# EAGLE schematic mx232JoeyAngShiYuan (EAGLE 8.1.0)
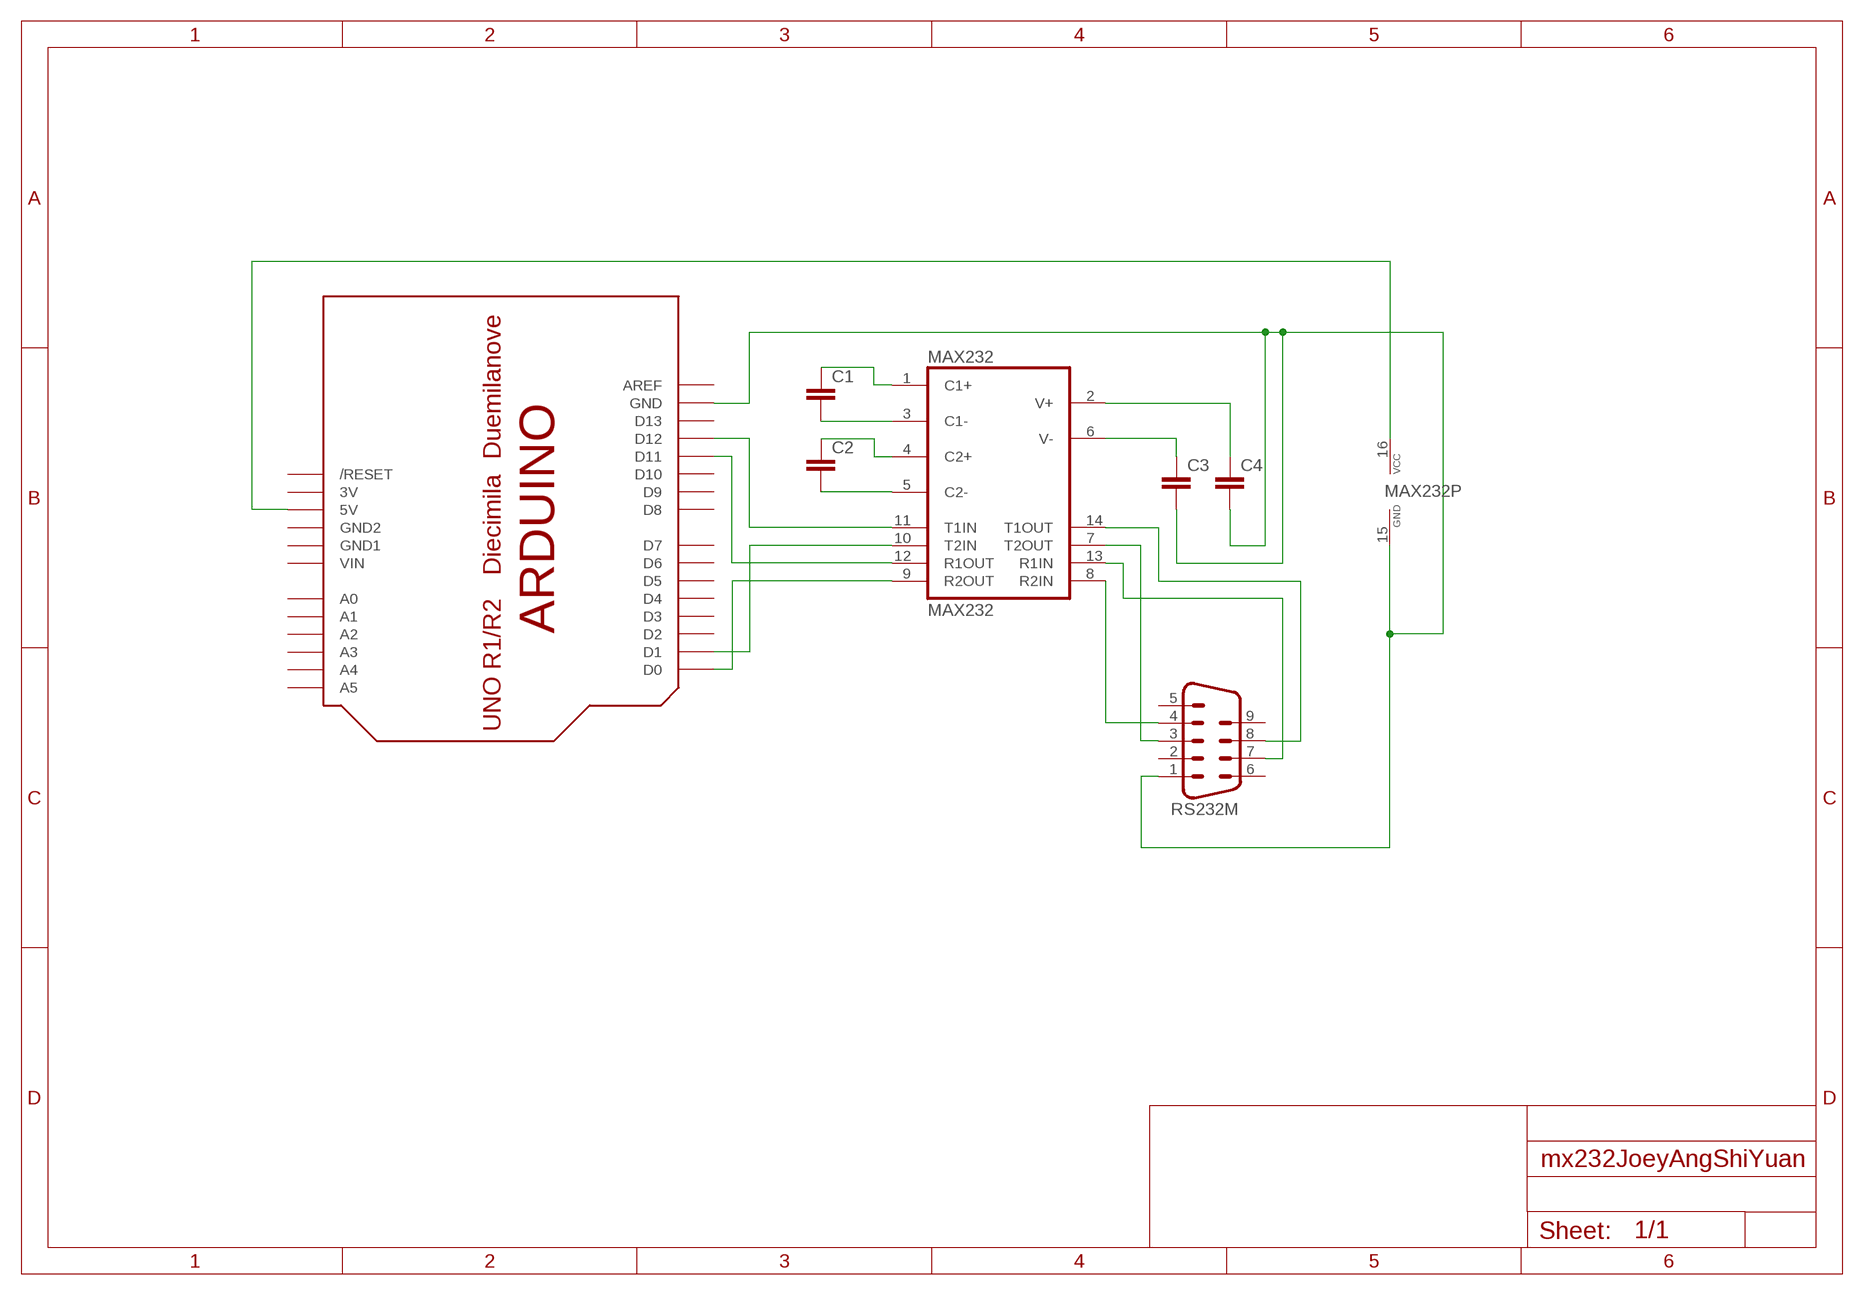
[diagram p0: schematic, sheet 1]

## Parts
C1  C2,5-3  [C2.5-3]
C2  C2,5-3  [C2.5-3]
C3  C2,5-3  [C2.5-3]
C4  C2,5-3  [C2.5-3]
LEONARDO-SHIELD  ARDUINO-NOHOLE  [ARDUINO-NOHOLE]
MAX232  MAX232  [DIL16]
RS232M  M09HP  [M09HP]

## Nets
N$1: LEONARDO-SHIELD.D11 MAX232.12(R1OUT)
N$2: LEONARDO-SHIELD.D0 MAX232.9(R2OUT)
N$3: LEONARDO-SHIELD.D1 MAX232.10(T2IN)
N$4: LEONARDO-SHIELD.D12 MAX232.11(T1IN)
N$5: C1.1 MAX232.1(C1+)
N$6: C1.2 MAX232.3(C1-)
N$7: C2.1 MAX232.4(C2+)
N$8: C2.2 MAX232.5(C2-)
N$9: C4.1 MAX232.2(V+)
N$10: C3.1 MAX232.6(V-)
N$11: C3.2 C4.2 LEONARDO-SHIELD.GND MAX232.15(GND) RS232M.1
N$12: LEONARDO-SHIELD.5V MAX232.16(VCC)
N$13: MAX232.14(T1OUT) RS232M.8
N$14: MAX232.7(T2OUT) RS232M.3
N$15: MAX232.13(R1IN) RS232M.7
N$16: MAX232.8(R2IN) RS232M.4
Unconnected: LEONARDO-SHIELD.A0 LEONARDO-SHIELD.A1 LEONARDO-SHIELD.A2 LEONARDO-SHIELD.A3 LEONARDO-SHIELD.A4 LEONARDO-SHIELD.A5 LEONARDO-SHIELD.AREF LEONARDO-SHIELD.D2 LEONARDO-SHIELD.D3 LEONARDO-SHIELD.D4 LEONARDO-SHIELD.D5 LEONARDO-SHIELD.D6 LEONARDO-SHIELD.D7 LEONARDO-SHIELD.D8 LEONARDO-SHIELD.D9 LEONARDO-SHIELD.D10 LEONARDO-SHIELD.D13 LEONARDO-SHIELD.RESET(/RESET) RS232M.2 RS232M.5 RS232M.6 RS232M.9

## Power pins joined to a net without a drawn wire
3V: LEONARDO-SHIELD.3V
GND1: LEONARDO-SHIELD.GND1
GND2: LEONARDO-SHIELD.GND2
VIN: LEONARDO-SHIELD.VIN

## Library data of the parts
C1-C4 = capacitor-wima:C: CAPACITOR naming: grid - package width
LEONARDO-SHIELD = adafruit:ARDUINO: Arduino Diecimila/Duemilanove Make a shield with ease, this package has all the named pins as well as the two mounting drill holes and an outline of the USB and DC power connector. The outline is on the DIMENSION layer, so if your board house uses it they will cut the outline to match. http://www.ladyada.net/library/pcb/eaglelibrary.html
MAX232 = maxim:MAX232: RS232 TRANSCEIVER; MF: MAXIM; MPN: MAX232ACPE+; OC_FARNELL: 9723773; OC_NEWARK: 68K4544
RS232M = con-subd:M09: SUB-D; OC_FARNELL: unknown; OC_NEWARK: unknown